# EAGLE design circularis (EAGLE 7.7.0)
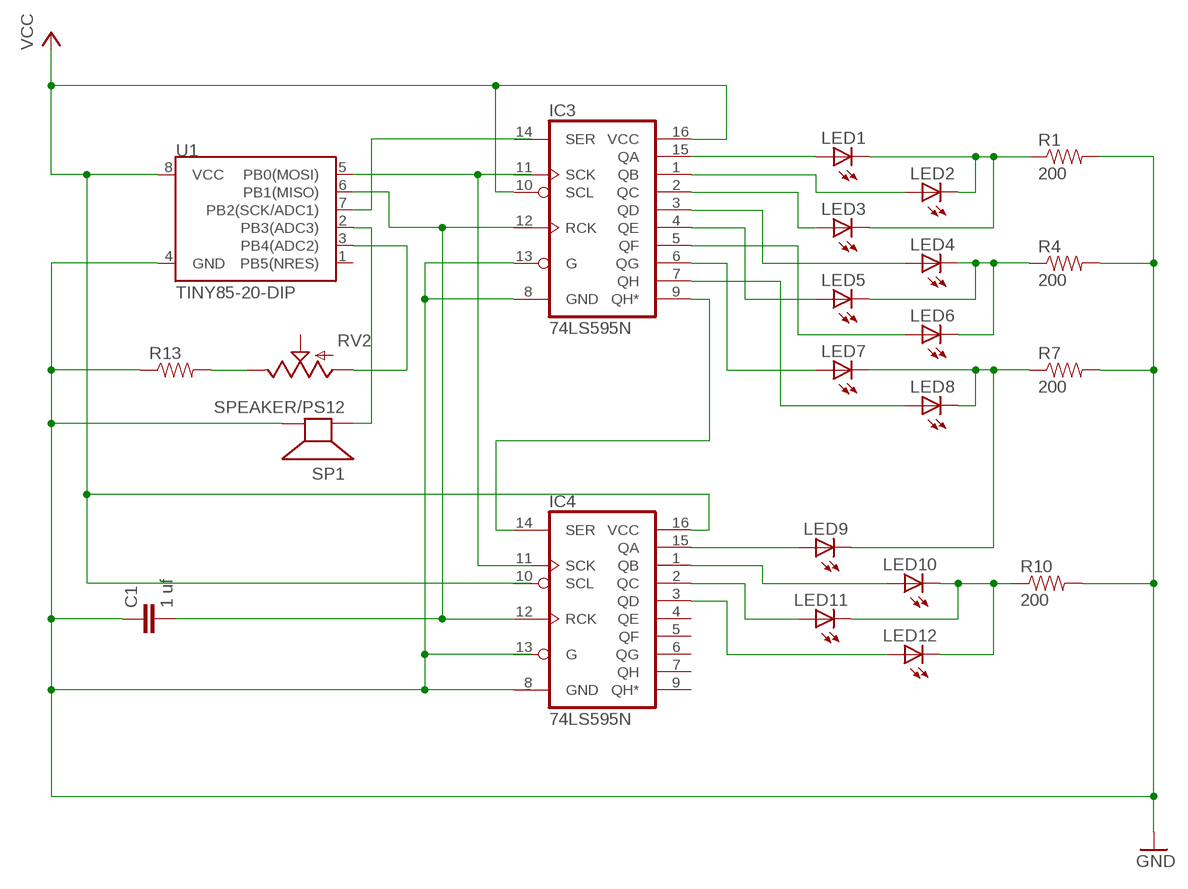
[diagram p0: schematic, sheet 1]

## Parts
C1  1 uf  CAPPTH1  [CAP-PTH-5MM]
IC3  74LS595N  [DIL16]
IC4  74LS595N  [DIL16]
LED1  LED5MM  [LED5MM]
LED2  LED5MM  [LED5MM]
LED3  LED5MM  [LED5MM]
LED4  LED5MM  [LED5MM]
LED5  LED5MM  [LED5MM]
LED6  LED5MM  [LED5MM]
LED7  LED5MM  [LED5MM]
LED8  LED5MM  [LED5MM]
LED9  LED5MM  [LED5MM]
LED10  LED5MM  [LED5MM]
LED11  LED5MM  [LED5MM]
LED12  LED5MM  [LED5MM]
R1  200  RESISTORPTH-1/4W  [AXIAL-0.4]
R4  200  RESISTORPTH-1/4W  [AXIAL-0.4]
R7  200  RESISTORPTH-1/4W  [AXIAL-0.4]
R10  200  RESISTORPTH-1/4W  [AXIAL-0.4]
R13  RESISTORPTH-1/4W  [AXIAL-0.4]
RV2  POT  [ALPS_POT]
SP1  SPEAKER/PS12  [PS12]
U1  TINY85-20-DIP  ATTINY45TINY85-20-DIP  [DIP08]

## Nets
GND: C1.1 IC3.8(GND) IC3.13(G) R1.P$2 R4.P$2 R7.P$2 R10.P$2 R13.P$1 SP1.P$2(-) U1.4(GND)
N$1: LED1.K(C) LED2.K(C) LED3.K(C) R1.P$1
N$2: IC3.9(QH*) IC4.14(SER)
N$3: IC3.10(SCL) IC3.16(VCC) IC4.16(VCC) U1.8(VCC)
N$4: LED4.K(C) LED5.K(C) LED6.K(C) R4.P$1
N$5: C1.2 IC4.12(RCK) U1.6(PB1(MISO))
N$6: U1.5(PB0(MOSI))
N$7: LED7.K(C) LED8.K(C) LED9.K(C) R7.P$1
N$8: U1.7(PB2(SCK/ADC1))
N$9: IC3.1(QB) LED2.A
N$10: IC3.2(QC) LED3.A
N$11: IC3.3(QD) LED4.A
N$12: IC3.4(QE) LED5.A
N$13: IC3.5(QF) LED6.A
N$14: IC3.6(QG) LED7.A
N$15: IC3.15(QA) LED1.A
N$16: R13.P$2 RV2.P$1(E)
N$18: RV2.P$3(A) U1.3(PB4(ADC2))
N$19: IC4.3(QD) LED12.A
N$20: IC3.7(QH) LED8.A
N$21: IC4.15(QA) LED9.A
N$22: IC4.1(QB) LED10.A
N$23: IC4.2(QC) LED11.A
N$24: SP1.P$1(+) U1.2(PB3(ADC3))
N$31: LED10.K(C) LED11.K(C) LED12.K(C) R10.P$1
Unconnected: IC3.11(SCK) IC3.12(RCK) IC3.14(SER) IC4.4(QE) IC4.5(QF) IC4.6(QG) IC4.7(QH) IC4.9(QH*) IC4.10(SCL) IC4.11(SCK) IC4.13(G) RV2.P$2(S) U1.1(PB5(NRES))

## Power pins joined to a net without a drawn wire
GND: IC4.8(GND)

## Library data of the parts
C1 = SparkFun-Capacitors:CAP: Capacitor Standard 0603 ceramic capacitor, and 0.1" leaded capacitor.
IC3 IC4 = SparkFun-DigitalIC:74*595: 8-bit SHIFT REGISTER, output latch
LED1-LED12 = adafruit:LED: LED OSRAM: - CHIPLED LG R971, LG N971, LY N971, LG Q971, LY Q971, LO R971, LY R971 LH N974, LH R974 LS Q976, LO Q976, LY Q976 LO Q996 - Hyper CHIPLED LW Q18S LB Q993, LB Q99A, LB R99A - SideLED LS A670, LO A670, LY A670, LG A670, LP A670 LB A673, LV A673, LT A673, LW A673 LH A674 LY A675 LS A676, LA A676, LO A676, LY A676, LW A676 LS A679, LY A679, LG A679 - Hyper Micro SIDELED® LS Y876, LA Y876, LO Y876, LY Y876 LT Y87S - SmartLED LW L88C, LW L88S LB L89C, LB L89S, LG L890 LS L89K, LO L89K, LY L89K LS L896, LA L896, LO L896, LY L896 - TOPLED LS T670, LO T670, LY T670, LG T670, LP T670 LSG T670, LSP T670, LSY T670, LOP T670, LYG T670 LG T671, LOG T671, LSG T671 LB T673, LV T673, LT T673, LW T673 LH T674 LS T676, LA T676, LO T676, LY T676, LB T676, LH T676, LSB T676, LW T676 LB T67C, LV T67C, LT T67C, LS T67K, LO T67K, LY T67K, LW E67C LS E67B, LA E67B, LO E67B, LY E67B, LB E67C, LV E67C, LT E67C LW T67C LS T679, LY T679, LG T679 LS T770, LO T770, LY T770, LG T770, LP T770 LB T773, LV T773, LT T773, LW T773 LH T774 LS E675, LA E675, LY E675, LS T675 LS T776, LA T776, LO T776, LY T776, LB T776 LHGB T686 LT T68C, LB T68C - Hyper Mini TOPLED® LB M676 - Mini TOPLED Santana® LG M470 LS M47K, LO M47K, LY M47K Source: http://www.osram.convergy.de/
R1 R4 R7 R10 R13 = SparkFun-Passives:RESISTOR: Resistor Basic schematic elements and footprints for 0603, 1206, and PTH resistors.
RV2 = SparkFun-Electromechanical:POT; PROD_ID: RES-09177
SP1 = adafruit:SPEAKER: SPEAKER Source: Buerklin Added PS12 (for part # PS1240 piezo) http://www.ladyada.net/library/pcb/eaglelibrary.html
U1 = SparkFun-DigitalIC:ATTINY45: Atmel 8-pin 2/4/8kB flash uC; PROD_ID: IC-09445

## Board
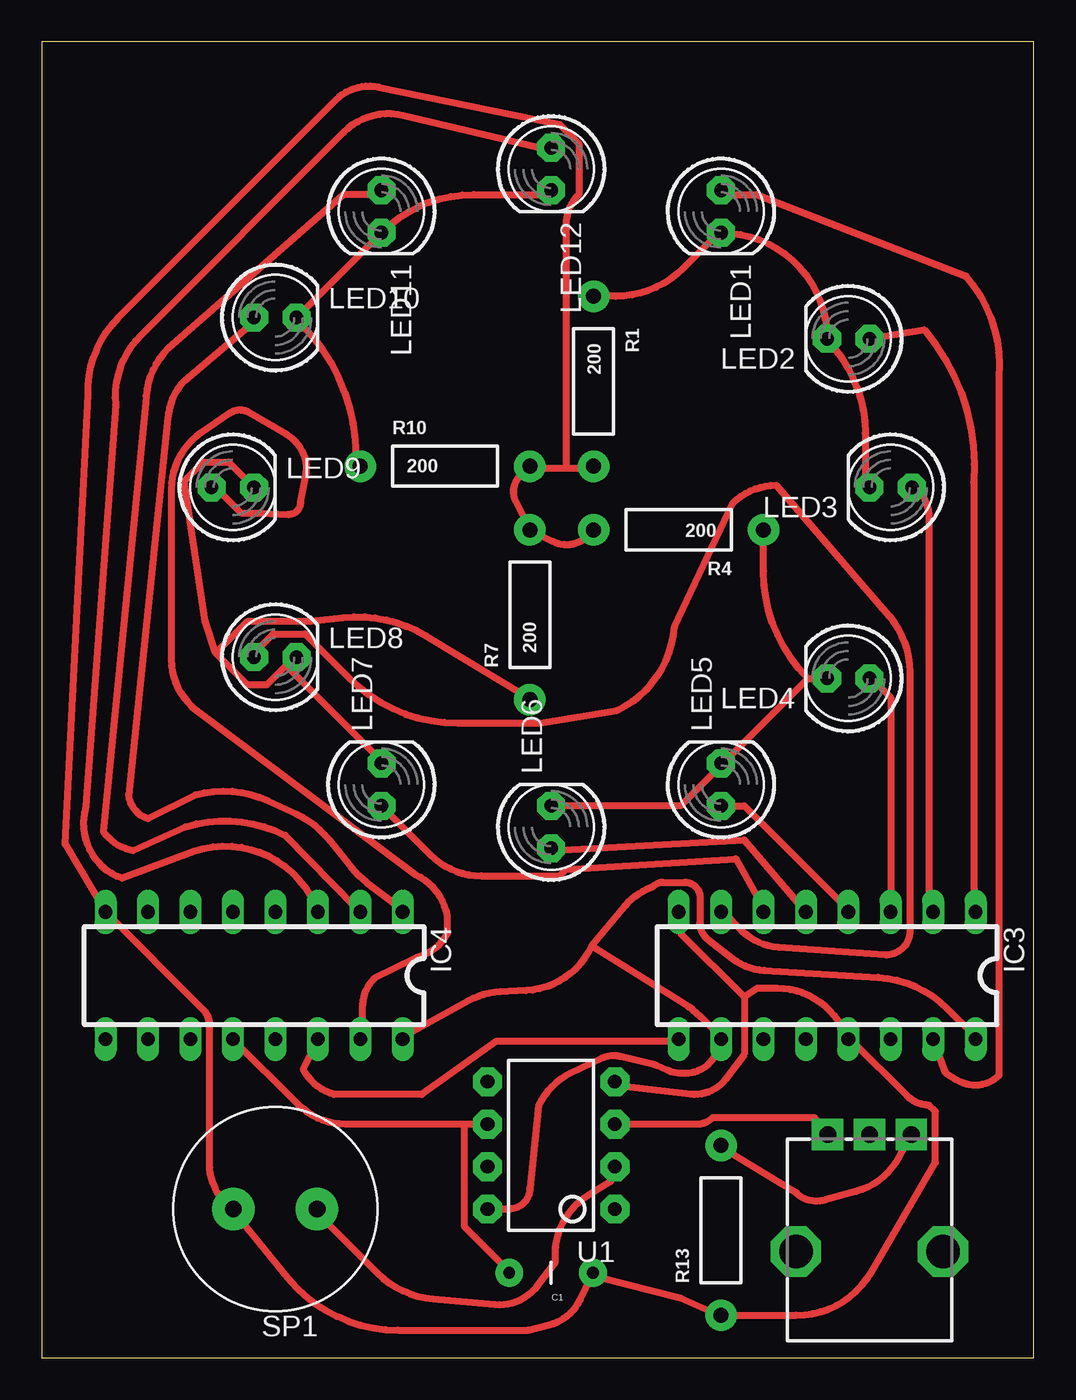
[diagram p1: board, top side]

Size 59.36 x 78.73 mm. Coordinates in mm from the lower left corner, seen from the top.
Outline: 0,0 59.36,0 59.36,78.73 0,78.73 0,0
Copper layers (1*16): Top 0.035mm / dielectric 1.5mm / Bottom 0.035mm
Design rules "default *": minimum track width 16mil, minimum drill 24mil, track to track 14mil, track to pad 10mil, pad to pad 10mil, via to via 10mil, smd to smd 8mil, copper to edge 40mil, drill to drill 8mil, minimum pad ring 10mil, minimum via ring 8mil, stop-mask expansion 4mil, vias tented up to drill 0mil, thermal gap 10mil

### Footprints (pad centres in the part's own frame; a part is rotated, then mirrored left to right if it is on the bottom)
CAP-PTH-5MM = drill 0.7 pad 1.651: 1 -2.5,0; 2 2.5,0
DIL16 = drill 0.813 long: 1 -8.89,-3.81; 2 -6.35,-3.81; 3 -3.81,-3.81; 4 -1.27,-3.81; 5 1.27,-3.81; 6 3.81,-3.81; 7 6.35,-3.81; 8 8.89,-3.81; 9 8.89,3.81; 10 6.35,3.81; 11 3.81,3.81; 12 1.27,3.81; 13 -1.27,3.81; 14 -3.81,3.81; 15 -6.35,3.81; 16 -8.89,3.81
LED5MM = drill 0.813 pad 1.676 octagon: A -1.27,0; K 1.27,0
AXIAL-0.4 = drill 0.9 pad 1.88: P$1 -5.08,0; P$2 5.08,0
ALPS_POT = drill 1 pad 1.88 square: P$1 7,-2.5; P$2 7,0; P$3 7,2.5 | drill 2 octagon: P$4 0,-4.4; P$5 0,4.4
PS12 = drill 1 pad 2.54: P$1 -2.5,0; P$2 2.5,0
DIP08 = drill 0.813 pad 1.727 octagon: 1 -3.81,-3.81; 2 -1.27,-3.81; 3 1.27,-3.81; 4 3.81,-3.81; 5 3.81,3.81; 6 1.27,3.81; 7 -1.27,3.81; 8 -3.81,3.81

### Placement (x,y rotation side)
C1  30.48,5.08 180 top
IC3  46.99,22.86 180 top
IC4  12.7,22.86 180 top
LED1  40.64,68.58 270 top
LED2  48.26,60.96 180 top
LED3  50.8,52.07 180 top
LED4  48.26,40.64 180 top
LED5  40.64,34.29 90 top
LED6  30.48,31.75 90 top
LED7  20.32,34.29 90 top
LED8  13.97,41.91 0 top
LED9  11.43,52.07 0 top
LED10  13.97,62.23 0 top
LED11  20.32,68.58 270 top
LED12  30.48,71.12 270 top
R1  33.02,58.42 270 top
R4  38.1,49.53 180 top
R7  29.21,44.45 90 top
R10  24.13,53.34 0 top
R13  40.64,7.62 90 top
RV2  49.53,6.35 90 top
SP1  13.97,8.89 180 top
U1  30.48,12.7 90 top

### Tracks (layer width: path | path; a pad name or v marks a point on that pad's centre or on a via)
GND
  Top 0.406: 42.04,21.59 42.8,22.1 43.99,22.1 arc-61 47.86,19.8 48.13,19.3 IC3.13 48.51,18.92 51.78,15.65 arc45 53.09,15.11 53.47,14.73 53.47,11.68 49.64,5.12 arc-60 45.14,2.54 R13.P$1 40.51,2.54 38.23,3.56 33.27,4.83 C1.1 32.89,4.83 32.21,3.46 arc-49 30.35,1.97 29.08,1.65 21.31,1.65 arc-51 14.71,4.78 11.56,8.64 SP1.P$2 11.18,9.02 11.11,9.08 arc-45 10.03,11.69 10.03,19.97 arc45 9.7,20.78 IC4.8 1.4,30.73 2.77,57.62 arc-47 4.58,62.24 17.6,75.26 arc-57 20.15,76.02 30.99,73.79 32.13,72.64 32.13,69.6 arc45 31.37,67.76 31.37,53.21 | 42.04,21.59 38.23,25.4 38.23,26.54 IC3.8 | 42.04,21.59 42.04,18.16 40.92,16.67 arc-59 38.83,15.76 34.42,16.26 U1.4 | R4.P$2 32.66,49.18 arc-72 30.59,48.84 R7.P$2 28.35,51.25 arc-72 28.59,52.72 R10.P$2 29.46,53.21 31.37,53.21 | 31.37,53.21 32.89,53.21 R1.P$2
N$1
  Top 0.406: LED3.K 49.28,52.07 49.28,55.31 arc45 46.99,60.83 LED2.K arc90 LED1.K 40.51,67.31 38.38,65.18 arc-45 34.33,63.5 R1.P$1
N$2
  Top 0.406: IC4.14 16.51,18.92 15.64,17.26 arc45 17.48,15.75 22.73,15.75 27.18,18.92 37.85,18.92 IC3.9
N$3
  Top 0.406: 32.89,24.64 arc-63 28.97,21.97 27.43,21.89 arc26 25.53,21.35 21.84,19.3 IC4.16 | 32.89,24.64 38.46,21.16 arc-13 39.43,20.38 40.51,19.3 IC3.10 40.35,18.27 arc-69 38.54,17.02 38.28,17.02 arc-24 37.45,17.19 36.79,17.49 arc11 36.61,17.55 34.61,18.02 arc39 33.5,17.91 31.62,17.02 arc37 29.73,15.11 29.21,10.16 arc-90 27.94,8.89 U1.8 | 32.89,24.64 34.89,27.04 arc-26 36.21,28.04 36.59,28.21 arc-45 37.17,28.45 38.47,28.45 arc-81 39.37,27.69 39.37,26.02 arc52 39.86,25.02 41.33,23.89 arc34 43.22,23.18 50.04,22.76 arc-41 54.16,20.9 55.75,19.3 IC3.16
N$4
  Top 0.406: LED6.K 38.23,33.02 40.51,35.31 LED5.K 40.89,35.69 45.85,40.64 | 45.85,40.64 LED4.K | 45.85,40.64 arc-45 43.18,47.08 R4.P$1
N$5
  Top 0.406: 25.27,13.97 18.17,13.97 arc-45 15.33,15.15 IC4.12 | U1.6 25.27,13.97 | 25.27,13.97 25.27,7.87 27.94,5.21 C1.2
N$7
  Top 0.406: LED9.K 11.18,53.59 9.65,53.59 8.51,52.45 9.78,44.07 10.41,42.16 | 10.41,42.16 12.32,40.26 13.46,40.26 14.6,41.4 | 14.6,41.4 14.99,41.78 LED8.K 14.6,41.4 | 14.6,41.4 20.32,35.69 LED7.K | 10.41,42.16 12.32,44.07 16.13,44.07 18.02,44.28 arc-38 23,43.18 29.08,39.5 R7.P$1
N$9
  Top 0.406: LED2.A 52.8,61.5 arc-45 55.75,52.36 55.75,26.92 IC3.1
N$10
  Top 0.406: IC3.2 53.09,26.92 53.09,50.23 arc45 52.32,52.07 LED3.A
N$11
  Top 0.406: IC3.3 50.8,39.5 49.66,40.64 LED4.A
N$12
  Top 0.406: LED5.A 42.04,33.02 48.13,26.92 IC3.4
N$13
  Top 0.406: IC3.5 42.04,30.99 30.61,30.35 LED6.A
N$14
  Top 0.406: LED7.A 23.26,30.08 arc45 26.29,28.83 30.99,28.83 31.37,29.21 41.53,29.84 43.18,26.92 IC3.6
N$15
  Top 0.406: IC3.15 54.1,17.02 54.76,16.6 arc77 57.28,16.89 57.28,58.68 arc45 55.3,64.71 42.8,69.6 40.89,69.6 LED1.A
N$16
  Top 0.406: R13.P$2 40.89,12.45 45.09,9.91 arc61 46.89,9.43 48.74,9.95 arc46 51.25,11.94 51.94,13.21 RV2.P$1
N$18
  Top 0.406: U1.3 39.21,13.97 arc45 40.13,14.35 46.23,14.35 46.99,13.59 RV2.P$3
N$19
  Top 0.406: IC4.3 arc89 9.13,30.32 4.78,28.7 arc-87 2.64,32.97 4.41,57 arc-50 5.92,61.16 18.07,73.32 arc-58 21.6,74.32 30.23,72.26 LED12.A
N$20
  Top 0.406: IC3.7 40.89,26.54 41.9,25.54 arc41 44.07,24.55 50.42,24.1 arc89 51.94,25.4 51.94,41.02 arc41 50.7,44.37 43.94,52.2 arc45 41.34,51.12 37.86,43.73 arc-60 34.42,38.73 29.84,37.97 24.89,37.97 arc-45 18.39,40.66 15.75,43.31 13.84,43.31 12.7,42.16 LED8.A
N$21
  Top 0.406: IC4.15 19.18,19.3 19.18,20.96 arc-45 19.89,22.69 22.4,23.92 arc45 24.26,25.34 24.26,26.44 arc53 22.39,28.89 9.25,38.75 arc-53 7.75,41.76 7.75,51.95 arc-55 9.52,55.32 11.24,56.51 arc-65 12.41,56.55 14.67,55.22 arc-71 15.8,52.69 15.49,51.18 arc-93 14.73,50.46 13.08,50.55 11.94,50.55 10.41,52.07 LED9.A
N$22
  Top 0.406: IC4.1 21.46,26.92 19.43,28.45 arc-15 18.53,29.32 17.21,30.97 arc26 15.24,32.52 13.54,33.31 arc40 9.18,33.67 6.35,32.26 arc-68 5.19,33.67 7.55,56.2 arc-42 8.56,58.47 12.7,61.98 LED10.A
N$23
  Top 0.406: IC4.2 18.8,26.92 14.57,31.25 arc43 8.59,31.77 5.47,30.34 arc-45 3.68,31.48 6.22,57.15 arc-45 7.57,60.4 18.03,69.6 20.32,69.6 LED11.A
N$24
  Top 0.406: U1.2 34.04,11.3 34.04,10.54 32.7,9.72 arc58 30.73,6.21 30.73,5.71 29.66,4.31 arc-58 27.12,3.19 23.42,3.51 arc-40 20.08,5.07 16.51,8.64 SP1.P$1
N$31
  Top 0.406: LED12.K 30.23,69.6 25.84,69.6 arc45 LED11.K LED10.K 15.37,61.98 15.52,61.83 arc-45 18.8,53.91 18.8,53.59 R10.P$1